# EAGLE schematic SCORCH (EAGLE 6.4)
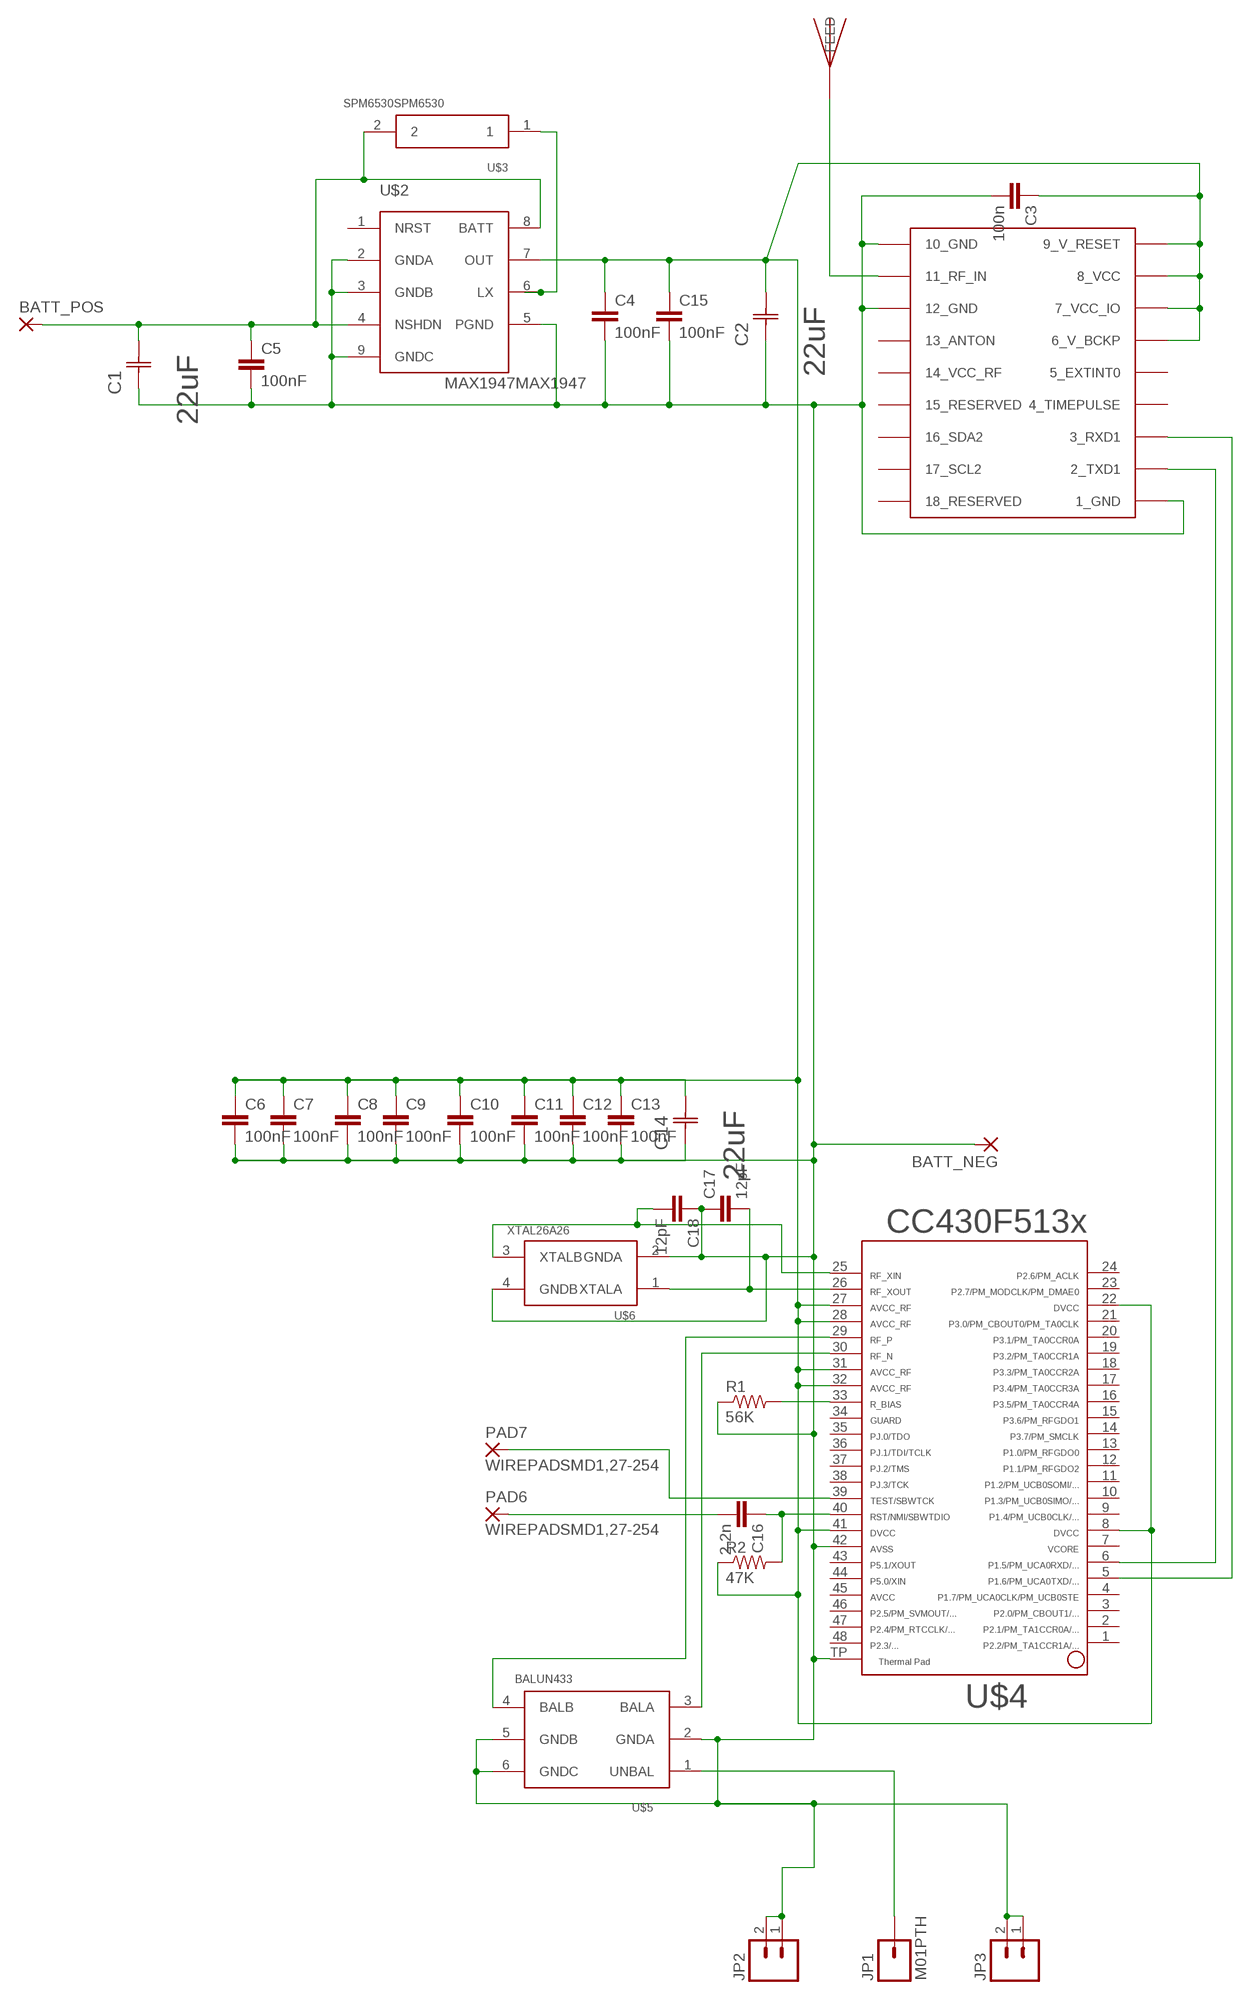
[diagram p0: schematic, sheet 1]

## Parts
BATT_NEG  SMD2  [SMD1,27-2,54]
BATT_POS  SMD2  [SMD1,27-2,54]
C1  22uF  U0805R102KCT  [CAPC2013X90N]
C2  22uF  U0805R102KCT  [CAPC2013X90N]
C3  100n  CAP0402-CAP  [0402-CAP]
C4  100nF  CAP0402-CAP  [0402-CAP]
C5  100nF  CAP0402-CAP  [0402-CAP]
C6  100nF  CAP0402-CAP  [0402-CAP]
C7  100nF  CAP0402-CAP  [0402-CAP]
C8  100nF  CAP0402-CAP  [0402-CAP]
C9  100nF  CAP0402-CAP  [0402-CAP]
C10  100nF  CAP0402-CAP  [0402-CAP]
C11  100nF  CAP0402-CAP  [0402-CAP]
C12  100nF  CAP0402-CAP  [0402-CAP]
C13  100nF  CAP0402-CAP  [0402-CAP]
C14  22uF  U0805R102KCT  [CAPC2013X90N]
C15  100nF  CAP0402-CAP  [0402-CAP]
C16  2.2n  CAP0402-CAP  [0402-CAP]
C17  12pF  CAP0402-CAP  [0402-CAP]
C18  12pF  CAP0402-CAP  [0402-CAP]
JP1  M01PTH  [1X01]
JP2  M02PTH  [1X02]
JP3  M02PTH  [1X02]
PAD6  WIREPADSMD1,27-254  [SMD1,27-2,54]
PAD7  WIREPADSMD1,27-254  [SMD1,27-2,54]
R1  56K  RESISTOR0603-RES  [0603-RES]
R2  47K  RESISTOR0603-RES  [0603-RES]
U$1  UBLOX_MAX-6  [UBLOX_MAX-6]
U$2  MAX1947MAX1947  [8QFN]
U$3  SPM6530SPM6530  [INDUCTOR]
U$4  CC430F513X---RGZ48  [RGZ48]
U$5  BALUN433  [BALUN]
U$6  XTAL26A26  [XTAL26]
U$7  JTI_ANTENNA-1575AT43A40  [JTI_ANTENNA-1575AT43A40]

## Nets
BATT: BATT_POS.1(P) C1.2(C2) C5.1 U$2.4(NSHDN) U$2.8(BATT) U$3.2
FRM_GPS: U$1.2_TXD1 U$4.6
GND: BATT_NEG.1(P) C1.1(C1) C2.1(C1) C3.2 C4.2 C5.2 C6.2 C7.2 C8.2 C9.2 C10.2 C11.2 C12.2 C13.2 C14.1(C1) C15.2 C17.1 C18.1 JP2.1 JP2.2 JP3.1 JP3.2 R1.1 U$1.1_GND U$1.10_GND U$1.12_GND U$2.2(GNDA) U$2.3(GNDB) U$2.5(PGND) U$2.9(GNDC) U$4.42 U$4.TP U$5.2(GNDA) U$5.5(GNDB) U$5.6(GNDC) U$6.2(GNDA) U$6.4(GNDB)
N$1: U$4.29 U$5.4(BALB)
N$2: U$4.30 U$5.3(BALA)
N$3: C16.1 R2.2 U$4.40
N$4: C17.2 U$4.26 U$6.1(XTALA)
N$5: C18.2 U$4.25 U$6.3(XTALB)
N$6: R1.2 U$4.33
N$10: U$2.6(LX) U$3.1
N$11: U$1.11_RF_IN U$7.FEED
N$13: PAD7.1(P) U$4.39
N$14: C16.2 PAD6.1(P)
RF_OUT: JP1.1 U$5.1(UNBAL)
TO_GPS: U$1.3_RXD1 U$4.5
VCC: C2.2(C2) C3.1 C4.1 C6.1 C7.1 C8.1 C9.1 C10.1 C11.1 C12.1 C13.1 C14.2(C2) C15.1 R2.1 U$1.6_V_BCKP U$1.7_VCC_IO U$1.8_VCC U$1.9_V_RESET U$2.7(OUT) U$4.8 U$4.22 U$4.27 U$4.28 U$4.31 U$4.32 U$4.41
Unconnected: U$1.4_TIMEPULSE U$1.5_EXTINT0 U$1.13_ANTON U$1.14_VCC_RF U$1.15_RESERVED U$1.16_SDA2 U$1.17_SCL2 U$1.18_RESERVED U$2.1(NRST) U$4.1 U$4.2 U$4.3 U$4.4 U$4.9 U$4.10 U$4.11 U$4.12 U$4.13 U$4.14 U$4.15 U$4.16 U$4.17 U$4.18 U$4.19 U$4.20 U$4.21 U$4.23 U$4.24 U$4.35 U$4.36 U$4.37 U$4.38 U$4.43 U$4.44 U$4.45 U$4.46 U$4.47 U$4.48

## Power pins joined to a net without a drawn wire
7: U$4.7
34: U$4.34

## Library data of the parts
BATT_NEG BATT_POS = wirepad:SMD2: SMD PAD
C1 C2 C14 = Multicomp_By_element14_Batch_1:U0805R102KCT: CAPACITOR, 0805; MPN: U0805R102KCT; OC_FARNELL: 9406344; OC_NEWARK: 38K9282; SUPPLIER: Multicomp; TOLERANCE: ±10%; VALUE: 1nF; VOLTAGERATING: 50V
C3-C13 C15-C18 = SparkFun:CAP: Capacitor Standard 0603 ceramic capacitor, and 0.1" leaded capacitor.
JP1 = SparkFun:M01: Header 1 Standard 1-pin 0.1" header. Use with straight break away headers (SKU : PRT-00116), right angle break away headers (PRT-00553), swiss pins (PRT-00743), machine pins (PRT-00117), and female headers (PRT-00115).
JP2 JP3 = SparkFun:M02: Header 2 Standard 2-pin 0.1" header. Use with straight break away headers (SKU : PRT-00116), right angle break away headers (PRT-00553), swiss pins (PRT-00743), machine pins (PRT-00117), and female headers (PRT-00115). Molex polarized connector foot print use with SKU : PRT-08233 with associated crimp pins and housings.
PAD6 PAD7 = wirepad:WIREPAD: Wire PAD connect wire on PCB
R1 R2 = SparkFun:RESISTOR: Resistor Basic schematic elements and footprints for 0603, 1206, and PTH resistors.
U$1 = Ava:UBLOX_MAX-6: UBLOX MAX-6
U$2 = SCORCH:MAX1947: MAX1947 - 1.8V Boost Reg 150mA from 0.7V - 2MHz Switch, 94% efficency http://onecall.farnell.com/maxim-integrated-products/max1947eta18-t/ic-dc-dc-conv-step-up-1-8v-8qfn/dp/1609613 http://www.farnell.com/datasheets/50237.pdf
U$3 = SCORCH:SPM6530: 3.3uH 6.8A Shielded Inductor http://onecall.farnell.com/tdk/spm6530t-3r3m/inductor-shielded-3-3uh-20/dp/2215612?crosssellid=2215612&crosssell=true&in_merch=true& http://www.farnell.com/datasheets/1649093.pdf
U$4 = TI_MSP430_v16:CC430F513X---RGZ48: ***CC430F513X***RGZ48 ** ** Rev 1.0 ** 06/2010 * http://focus.ti.com/docs/prod/folders/print/cc430f5137.html
U$5 = SCORCH:BALUN433: 433MHz BALUN for CC430, CC1101 http://onecall.farnell.com/johanson-technology/0433bm15a0001e/balun-433mhz-impedance-matched/dp/2148531 http://www.farnell.com/datasheets/1643108.pdfhttp://www.farnell.com/datasheets/1643108.pdf
U$6 = SCORCH:XTAL26: 26MHz XTAL for CC430 - 10ppm http://onecall.farnell.com/aker/c3e-26-000-12-1010-x/crystal-2-5x3mm-cer-26-000mhz/dp/1640981 http://www.farnell.com/datasheets/75412.pdf
U$7 = Ava:JTI_ANTENNA-1575AT43A40